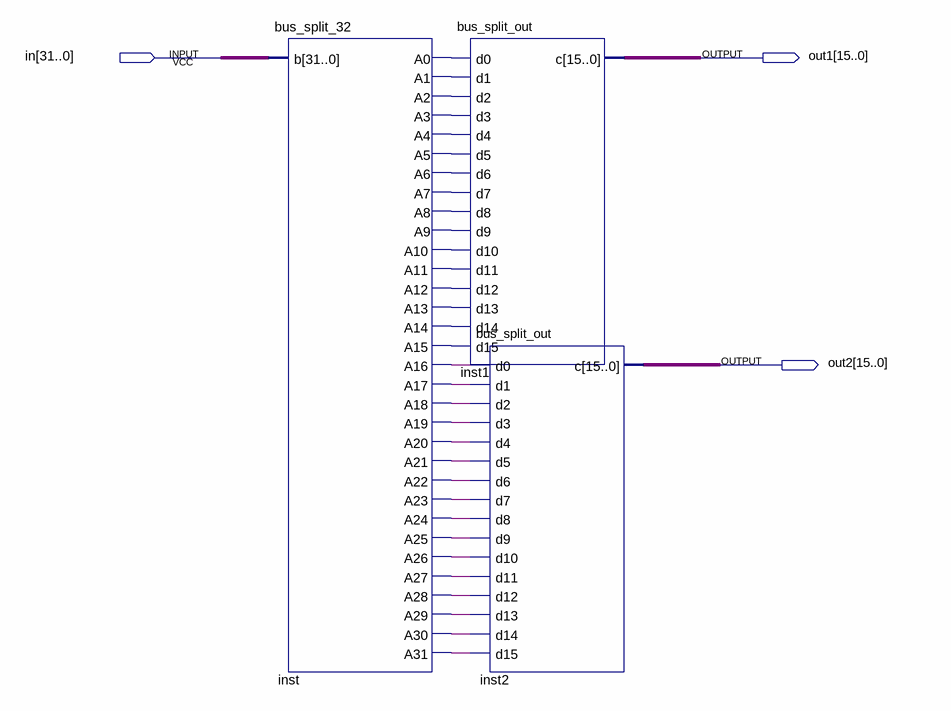
[diagram p0: schematic sheet]
// Quartus schematic bus32_16.bdf as structural Verilog: 3 symbols, 3 pins
module bus32_16 (
  input  [31:0] in,
  output [15:0] out1,
  output [15:0] out2
);

  wire inst_a0, inst_a1, inst_a2, inst_a3, inst_a4, inst_a5, inst_a6, inst_a7, inst_a8, inst_a9, inst_a10,
       inst_a11, inst_a12, inst_a13, inst_a14, inst_a15, inst_a16, inst_a17, inst_a18, inst_a19, inst_a20,
       inst_a21, inst_a22, inst_a23, inst_a24, inst_a25, inst_a26, inst_a27, inst_a28, inst_a29, inst_a30,
       inst_a31;

  bus_split_32 inst (
    .b(in), .A0(inst_a0), .A1(inst_a1), .A2(inst_a2), .A3(inst_a3), .A4(inst_a4), .A5(inst_a5), .A6(inst_a6),
    .A7(inst_a7), .A8(inst_a8), .A9(inst_a9), .A10(inst_a10), .A11(inst_a11), .A12(inst_a12), .A13(inst_a13),
    .A14(inst_a14), .A15(inst_a15), .A16(inst_a16), .A17(inst_a17), .A18(inst_a18), .A19(inst_a19),
    .A20(inst_a20), .A21(inst_a21), .A22(inst_a22), .A23(inst_a23), .A24(inst_a24), .A25(inst_a25),
    .A26(inst_a26), .A27(inst_a27), .A28(inst_a28), .A29(inst_a29), .A30(inst_a30), .A31(inst_a31));
  bus_split_out inst1 (
    .d0(inst_a0), .d1(inst_a1), .d2(inst_a2), .d3(inst_a3), .d4(inst_a4), .d5(inst_a5), .d6(inst_a6),
    .d7(inst_a7), .d8(inst_a8), .d9(inst_a9), .d10(inst_a10), .d11(inst_a11), .d12(inst_a12), .d13(inst_a13),
    .d14(inst_a14), .d15(inst_a15), .c(out1));
  bus_split_out inst2 (
    .d0(inst_a16), .d1(inst_a17), .d2(inst_a18), .d3(inst_a19), .d4(inst_a20), .d5(inst_a21), .d6(inst_a22),
    .d7(inst_a23), .d8(inst_a24), .d9(inst_a25), .d10(inst_a26), .d11(inst_a27), .d12(inst_a28),
    .d13(inst_a29), .d14(inst_a30), .d15(inst_a31), .c(out2));
endmodule
